# Altium schematic sheet Schematic_Ej3_Amp_Instrumentacion.SchDoc
size A4
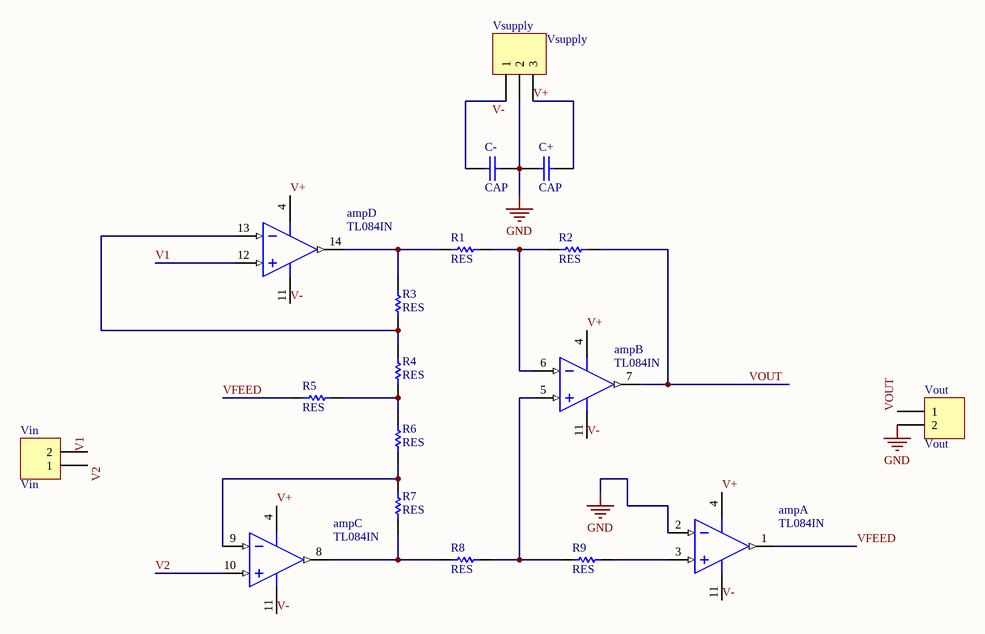
[diagram p0: Schematic_Ej3_Amp_Instrumentacion.SchDoc]

## Parts
amp  TL084IN  [TI-N14]  (parts A,B,C,D of 4)
C+  CAP  [CAP200]
C-  CAP  [CAP200]
R1  RES  [0805]
R2  RES  [0805]
R3  RES  [0805]
R4  RES  [0805]
R5  RES  [0805]
R6  RES  [0805]
R7  RES  [0805]
R8  RES  [0805]
R9  RES  [0805]
Vin  Vin  [HDR1X2]
Vout  Vout  [HDR1X2]
Vsupply  Vsupply  [HDR1X3]

## Nets
GND: amp.2(IN1-) C+.1 C-.2 Vout.2 Vsupply.2
V1: amp.12(IN4+) Vin.2
V2: amp.10(IN3+) Vin.1
V+: amp.4(VCC+) C+.2 Vsupply.3
V-: amp.11(VCC-) C-.1 Vsupply.1
VFEED: amp.1(OUT1) R5.1
VOUT: amp.7(OUT2) R2.1 Vout.1
Netamp_3: amp.3(IN1+) R9.2
Netamp_5: amp.5(IN2+) R8.2 R9.1
Netamp_6: amp.6(IN2-) R1.1 R2.2
Netamp_8: amp.8(OUT3) R7.1 R8.1
Netamp_9: amp.9(IN3-) R6.2 R7.2
Netamp_13: amp.13(IN4-) R3.1 R4.2
Netamp_14: amp.14(OUT4) R1.2 R3.2
NetR4_1: R4.1 R5.2 R6.1

## Library data of the parts
amp = TL084IN: JFET-Input Operational Amplifier, 7 to 36 V, -40 to 85 degC, 14-pin DIP (N14), Pb-Free (RoHS); Manufacturer: Texas Instruments; CMRR(Min)(dB): 75; GBW(Typ)(MHz): 3; IIB(Max)(pA): 200; Iq per channel(Max)(mA): 2.8; Number of Channels: 4; Offset Drift(Typ)(uV/C): 18; Rating: Catalog; Slew Rate(Typ)(V/us): 13; Sub Family: General Purpose Amplifier, High Supply Voltage Amplifier (>=30V); Total Supply Voltage(Max)(+5V is 5, +/-5V is 10): 36; Total Supply Voltage(Min)(+5V is 5, +/-5V is 10): 7; Vio (25C)(Max)(mV): 6; DatasheetVersion: SLOS081G; PackageVersion: 4040049/E, 12/2002; PackageReference: N14; PackageDescription: 14-Pin Plastic In-Line, Body 19.305 x 6.35 mm, Pitch 2.54 mm; Supplier 1: Digi-Key; Supplier Part Number 1: 296-7213-5-ND; Supplier 2: Farnell; Supplier Part Number 2: 1387834; Supplier 3: Newark; Supplier Part Number 3: 60K6994; Supplier 4: Mouser; Supplier Part Number 4: 595-TL084IN; Eco-Plan: Pb-Free (RoHS); Vn at 1kHz(Typ)(nV/rtHz): 18; Mounting Technology: Through Hole; Code_JEDEC: MS-001; PartNumber: TL084IN; ComponentLink1Description: Manufacturer URL; ComponentLink1URL: http://www.ti.com/; ComponentLink2Description: Datasheet; ComponentLink2URL: http://www.ti.com/lit/ds/symlink/tl084.pdf; ComponentLink3Description: Package Specification; ComponentLink3URL: http://www.ti.com/lit/ml/mpdi002c/mpdi002c.pdf
Vin Vout = Header 2: Header, 2-Pin; LatestRevisionDate: 17-Jul-2002; LatestRevisionNote: Re-released for DXP Platform.; Publisher: Altium Limited
Vsupply = Header 3: Header, 3-Pin; LatestRevisionDate: 17-Jul-2002; LatestRevisionNote: Re-released for DXP Platform.; Publisher: Altium Limited